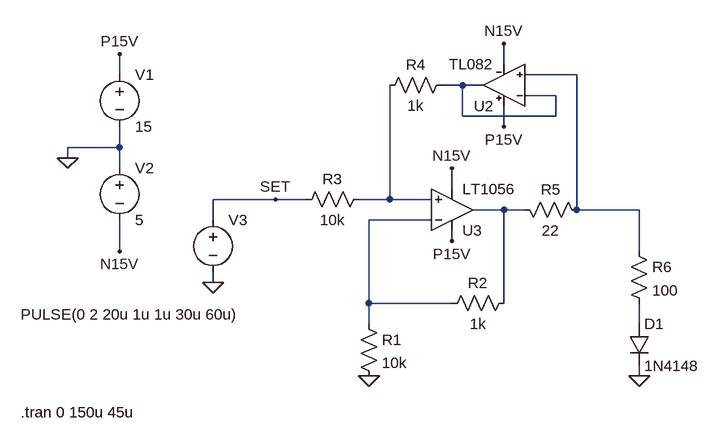
[diagram p0: schematic Programmable_HowlandCurrentSource.asc]
Programmable_HowlandCurrentSource.asc, the LTspice schematic file:
Version 4
SHEET 1 900 680
WIRE 240 -16 240 -48
WIRE -352 0 -352 -32
WIRE 352 0 272 0
WIRE 176 16 144 16
WIRE 208 16 176 16
WIRE 320 32 272 32
WIRE 176 64 176 16
WIRE 320 64 320 32
WIRE 320 64 176 64
WIRE 240 80 240 48
WIRE -352 112 -352 80
WIRE -352 112 -432 112
WIRE -432 128 -432 112
WIRE -352 144 -352 112
WIRE 160 176 160 144
WIRE -112 192 -208 192
WIRE -64 192 -112 192
WIRE 64 192 64 16
WIRE 64 192 16 192
WIRE 128 192 64 192
WIRE 240 208 192 208
WIRE 272 208 240 208
WIRE 352 208 352 0
WIRE 448 208 352 208
WIRE -208 224 -208 192
WIRE 128 224 32 224
WIRE 160 256 160 240
WIRE -352 272 -352 224
WIRE 448 272 448 208
WIRE -208 320 -208 304
WIRE 32 352 32 224
WIRE 160 352 32 352
WIRE 240 352 240 208
WIRE 32 384 32 352
WIRE 448 384 448 352
WIRE 448 464 448 448
FLAG -432 128 0
FLAG -352 -32 P15V
FLAG 160 256 P15V
FLAG 240 80 P15V
FLAG -352 272 N15V
FLAG 160 144 N15V
FLAG 240 -48 N15V
FLAG -208 320 0
FLAG -112 192 SET
FLAG 32 464 0
FLAG 448 464 0
SYMBOL voltage -352 -16 R0
WINDOW 123 0 0 Left 0
WINDOW 39 0 0 Left 0
SYMATTR InstName V1
SYMATTR Value 15
SYMBOL voltage -352 128 R0
WINDOW 123 0 0 Left 0
WINDOW 39 0 0 Left 0
SYMATTR InstName V2
SYMATTR Value 5
SYMBOL TL082 240 80 R180
SYMATTR InstName U2
SYMBOL voltage -208 208 R0
WINDOW 3 -296 161 Left 2
WINDOW 123 0 0 Left 0
WINDOW 39 0 0 Left 0
SYMATTR Value PULSE(0 2 20u 1u 1u 30u 60u)
SYMATTR InstName V3
SYMBOL res 16 368 R0
SYMATTR InstName R1
SYMATTR Value 10k
SYMBOL res 256 336 R90
WINDOW 0 0 56 VBottom 2
WINDOW 3 32 56 VTop 2
SYMATTR InstName R2
SYMATTR Value 1k
SYMBOL res 32 176 R90
WINDOW 0 0 56 VBottom 2
WINDOW 3 32 56 VTop 2
SYMATTR InstName R3
SYMATTR Value 10k
SYMBOL res 160 0 R90
WINDOW 0 0 56 VBottom 2
WINDOW 3 32 56 VTop 2
SYMATTR InstName R4
SYMATTR Value 1k
SYMBOL res 256 192 M90
WINDOW 0 0 56 VBottom 2
WINDOW 3 32 56 VTop 2
SYMATTR InstName R5
SYMATTR Value 22
SYMBOL res 432 256 R0
SYMATTR InstName R6
SYMATTR Value 100
SYMBOL diode 432 384 R0
SYMATTR InstName D1
SYMATTR Value 1N4148
SYMBOL OpAmps\\LT1056 160 272 M180
SYMATTR InstName U3
TEXT -504 520 Left 2 !.tran 0 150u 45u

The netlist it stands for:
* Programmable_HowlandCurrentSource.asc
V1 P15V 0 15
V2 0 N15V 5
XU2 N001 N002 P15V N15V N002 AD549  ; pins In+ In- V+ V- OUT
V3 SET 0 PULSE(0 2 20u 1u 1u 30u 60u)
R1 N005 0 10k
R2 N004 N005 1k
R3 N003 SET 10k
R4 N002 N003 1k
R5 N004 N001 22
R6 N001 N006 100
D1 N006 0 1N4148
XU3 N003 N005 P15V N15V N004 LT1056  ; pins In+ In- V+ V- OUT
.model D D
.lib standard.dio
.tran 0 150u 45u
.lib ADI1.lib
.backanno
.end